# Altium schematic sheet Cover.SchDoc
size A3; DocumentNumber: 1; SheetNumber: 1; SheetTotal: 5; PreparedBy: berkay; ReleaseDate: 23.11.2024; ENG_APP_DATE: --/--/--; DSN_APP_DATE: --/--/--; CHK_APP_DATE: --/--/--; ProjectUnit: mm
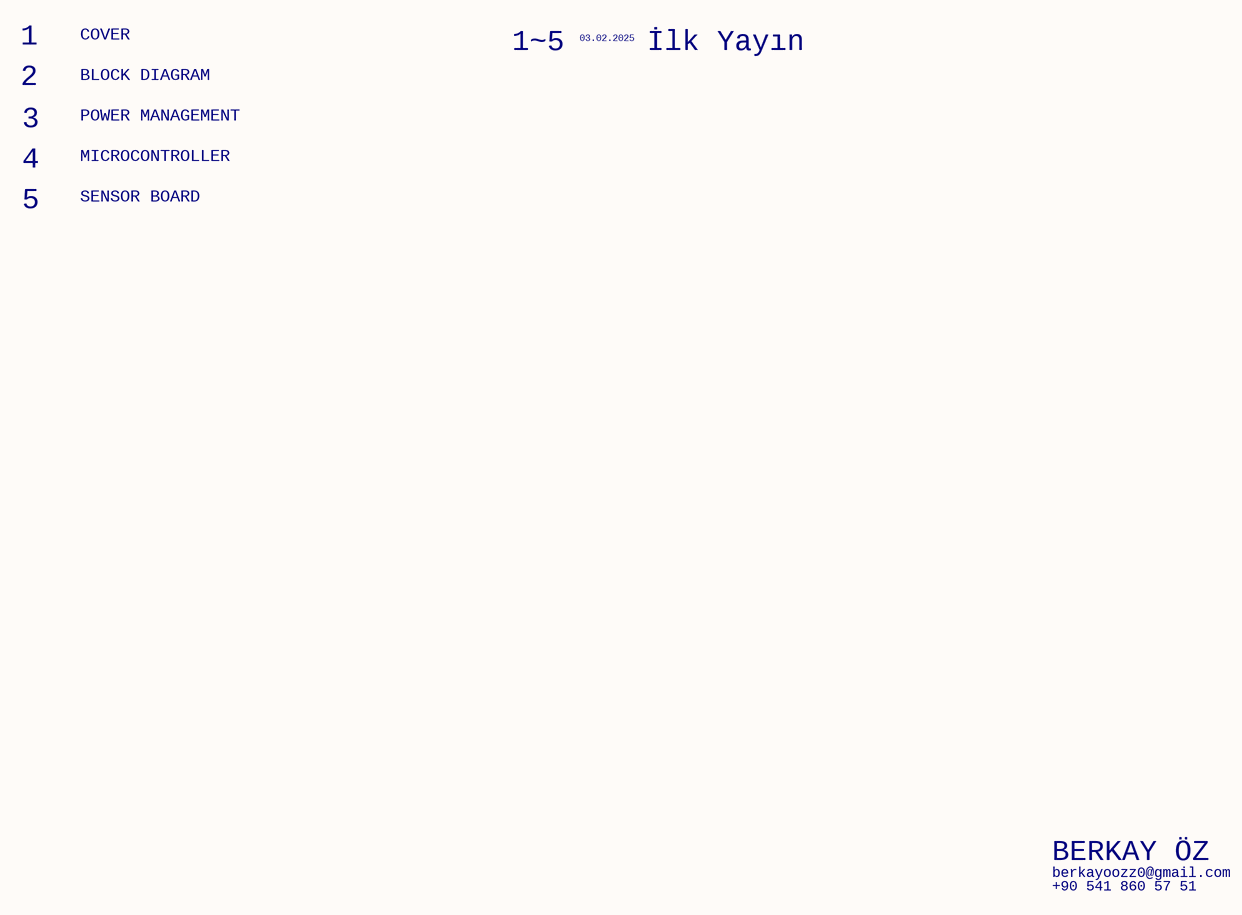
[diagram p0: Cover.SchDoc]

## Notes on the sheet
- 1
- COVER
- 1~5
- 03.02.2025
- İlk Yayın
- 2
- BLOCK DIAGRAM
- POWER MANAGEMENT
- 3
- 4
- MICROCONTROLLER
- 5
- SENSOR BOARD
- BERKAY ÖZ
- berkayoozz0@gmail.com
- +90 541 860 57 51
- Sayfa Nu.
- İÇİNDEKİLER / CONTENTS
- Tarih
- REVİZYON / REVISION
- ÜRETİM NOTLARI / PRODUCTION NOTES
- Page No
- Açıklama / Description
- Date
- Özellikleri
- Kart
- Features
- Board
- /
- Çıktıları
- Üretim
- Gerber
- Files
- Ekler
- Attachments
- İLETİŞİM / CONTACT
- File Name:
- Prepared:
- Size:
- Description:
- Unit:
- A3
- Released:
- Edited:
- Revision:
- Checked:
- Department:
- Approved:
- Sheet: